# EAGLE schematic drum_controller (EAGLE 9.1.2)
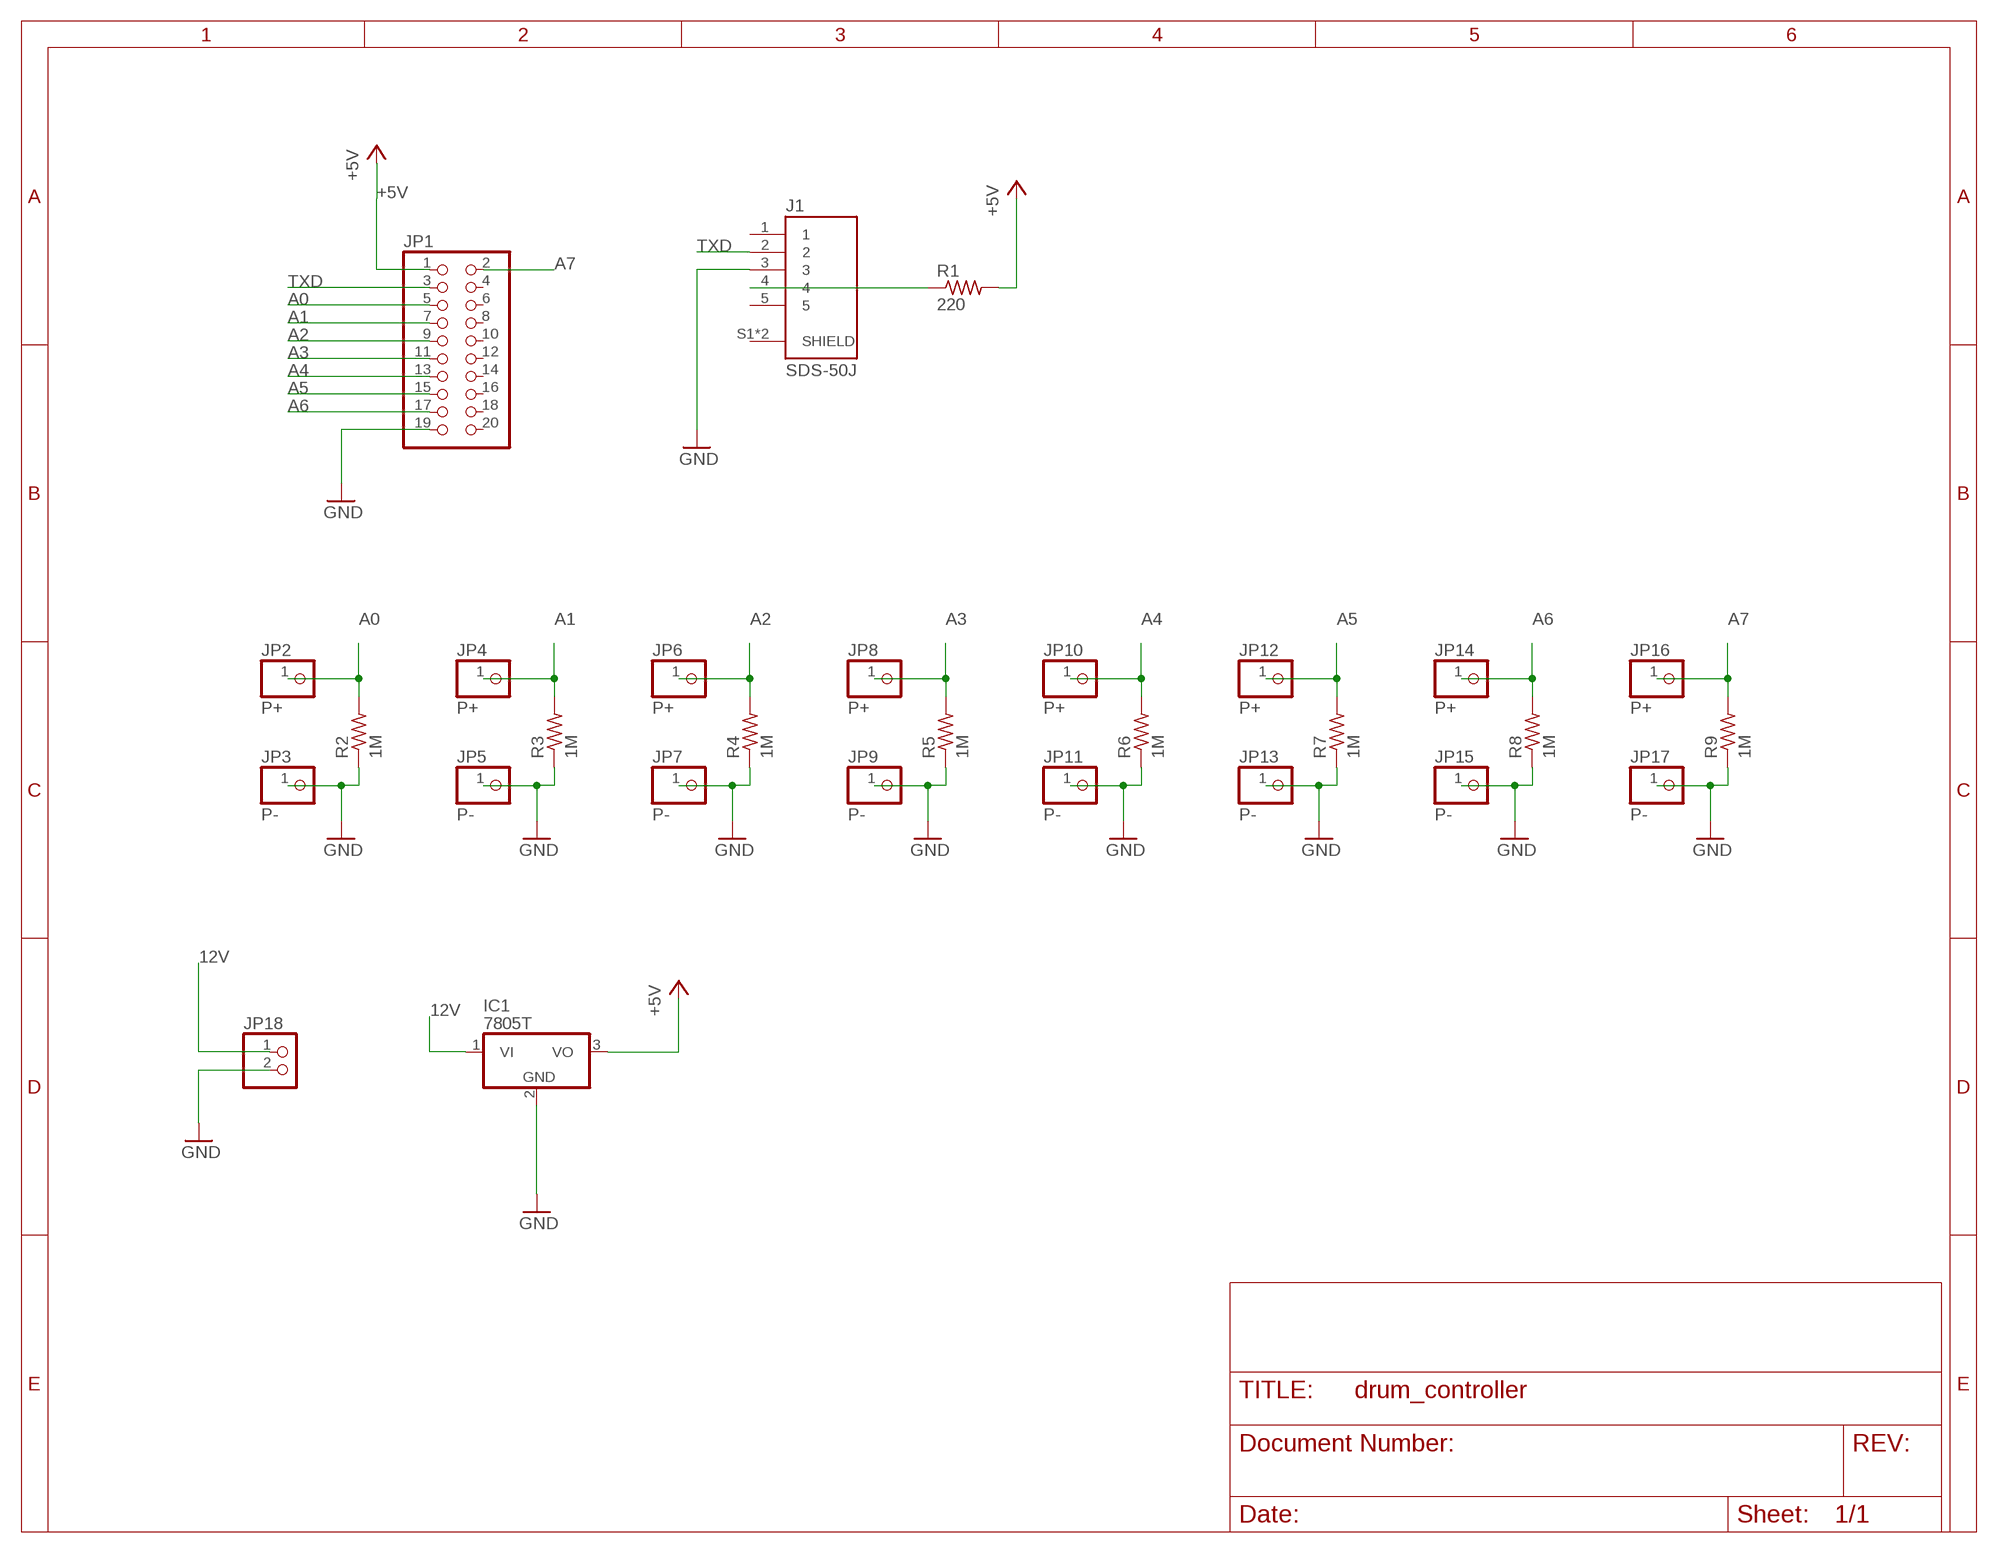
[diagram p0: schematic, sheet 1]

## Parts
IC1  7805T  [TO220H]
J1  SDS-50J  [CUI_SDS-50J]
JP1  PINHD-2X10  [2X10]
JP2  P+  PINHD-1X1  [1X01]
JP3  P-  PINHD-1X1  [1X01]
JP4  P+  PINHD-1X1  [1X01]
JP5  P-  PINHD-1X1  [1X01]
JP6  P+  PINHD-1X1  [1X01]
JP7  P-  PINHD-1X1  [1X01]
JP8  P+  PINHD-1X1  [1X01]
JP9  P-  PINHD-1X1  [1X01]
JP10  P+  PINHD-1X1  [1X01]
JP11  P-  PINHD-1X1  [1X01]
JP12  P+  PINHD-1X1  [1X01]
JP13  P-  PINHD-1X1  [1X01]
JP14  P+  PINHD-1X1  [1X01]
JP15  P-  PINHD-1X1  [1X01]
JP16  P+  PINHD-1X1  [1X01]
JP17  P-  PINHD-1X1  [1X01]
JP18  PINHD-1X2  [1X02]
R1  220  R-US_0817/22  [P0817/22]
R2  1M  R-US_0817/22  [P0817/22]
R3  1M  R-US_0817/22  [P0817/22]
R4  1M  R-US_0817/22  [P0817/22]
R5  1M  R-US_0817/22  [P0817/22]
R6  1M  R-US_0817/22  [P0817/22]
R7  1M  R-US_0817/22  [P0817/22]
R8  1M  R-US_0817/22  [P0817/22]
R9  1M  R-US_0817/22  [P0817/22]

## Nets
12V: IC1.1(VI) JP18.1
+5V: IC1.3(VO) JP1.1 R1.2
A0: JP1.5 JP2.1 R2.2
A1: JP1.7 JP4.1 R3.2
A2: JP1.9 JP6.1 R4.2
A3: JP1.11 JP8.1 R5.2
A4: JP1.13 JP10.1 R6.2
A5: JP1.15 JP12.1 R7.2
A6: JP1.17 JP14.1 R8.2
A7: JP1.2 JP16.1 R9.2
GND: IC1.2(GND) J1.3 JP1.19 JP3.1 JP5.1 JP7.1 JP9.1 JP11.1 JP13.1 JP15.1 JP17.1 JP18.2 R2.1 R3.1 R4.1 R5.1 R6.1 R7.1 R8.1 R9.1
N$1: J1.4 R1.1
TXD: J1.2 JP1.3
Unconnected: J1.1 J1.5 J1.S1(SHIELD) J1.S2(SHIELD) JP1.4 JP1.6 JP1.8 JP1.10 JP1.12 JP1.14 JP1.16 JP1.18 JP1.20

## Library data of the parts
IC1 = adafruit:78*: Positive VOLTAGE REGULATOR Added bigger pads to the TO-92 package
J1 = SDS-50J:SDS-50J: Standard Din Connector 5 Pin, Right-Angle Receptacle, 180°; MF: CUI Inc; STANDARD: Manufacturer recommendations
JP1 = pinhead:PINHD-2X10: PIN HEADER
JP2-JP17 = pinhead:PINHD-1X1: PIN HEADER
JP18 = pinhead:PINHD-1X2: PIN HEADER
R1-R9 = rcl:R-US_: RESISTOR, American symbol